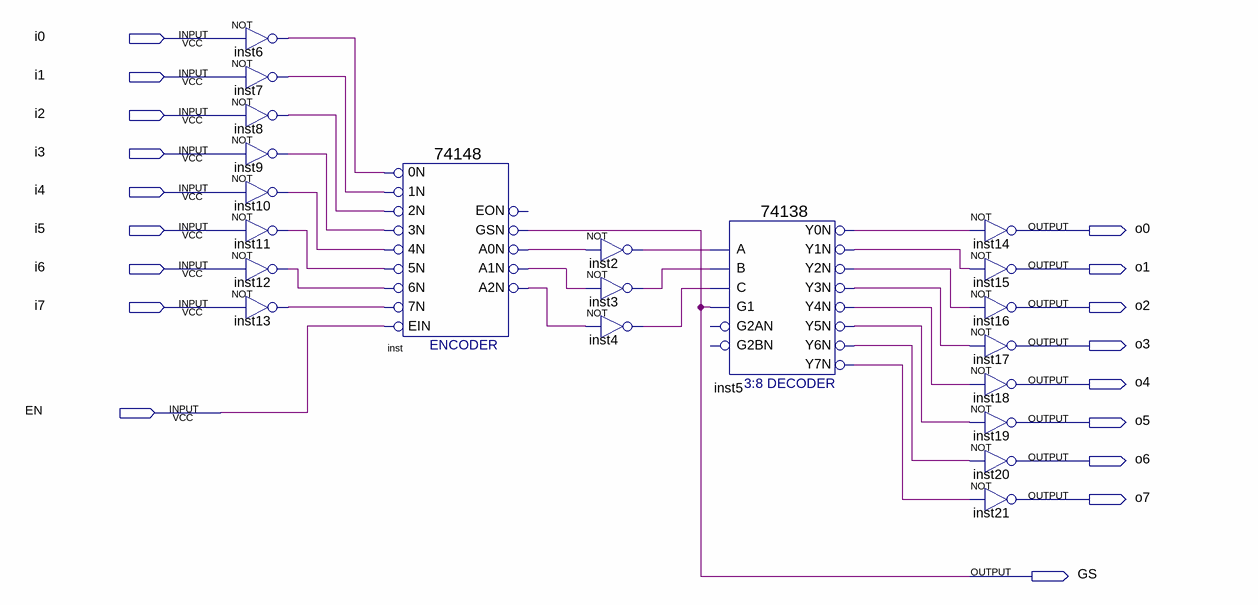
[diagram p0: schematic sheet]
// Quartus schematic fSwitch8.bdf as structural Verilog: 21 symbols, 18 pins
module fSwitch8 (
  input  i0,
  input  i1,
  input  i2,
  input  i3,
  input  i4,
  input  i5,
  input  i6,
  input  i7,
  input  EN,
  output o0,
  output o1,
  output o2,
  output o3,
  output o4,
  output o5,
  output o6,
  output o7,
  output GS
);

  wire inst2_out, inst3_out, inst4_out, inst5_y0n, inst5_y1n, inst5_y2n, inst5_y3n, inst5_y4n, inst5_y5n,
       inst5_y6n, inst5_y7n, inst6_out, inst7_out, inst8_out, inst9_out, inst10_out, inst11_out, inst12_out,
       inst13_out, inst_a0n, inst_a1n, inst_a2n;

  not inst6 (inst6_out, i0);
  not inst7 (inst7_out, i1);
  not inst8 (inst8_out, i2);
  not inst9 (inst9_out, i3);
  not inst10 (inst10_out, i4);
  not inst11 (inst11_out, i5);
  not inst12 (inst12_out, i6);
  not inst13 (inst13_out, i7);
  \74148  inst (
    .\5N (inst11_out), .\0N (inst6_out), .\1N (inst7_out), .\2N (inst8_out), .\3N (inst9_out),
    .\4N (inst10_out), .EIN(EN), .\6N (inst12_out), .\7N (inst13_out), .A1N(inst_a1n), .A0N(inst_a0n),
    .A2N(inst_a2n), .GSN(GS));  // open: EON
  not inst2 (inst2_out, inst_a0n);
  not inst3 (inst3_out, inst_a1n);
  not inst4 (inst4_out, inst_a2n);
  \74138  inst5 (
    .A(inst2_out), .B(inst3_out), .G1(GS), .C(inst4_out), .Y0N(inst5_y0n), .Y1N(inst5_y1n), .Y2N(inst5_y2n),
    .Y3N(inst5_y3n), .Y4N(inst5_y4n), .Y5N(inst5_y5n), .Y6N(inst5_y6n), .Y7N(inst5_y7n));  // open: G2AN, G2BN
  not inst14 (o0, inst5_y0n);
  not inst15 (o1, inst5_y1n);
  not inst16 (o2, inst5_y2n);
  not inst17 (o3, inst5_y3n);
  not inst18 (o4, inst5_y4n);
  not inst19 (o5, inst5_y5n);
  not inst20 (o6, inst5_y6n);
  not inst21 (o7, inst5_y7n);
endmodule
